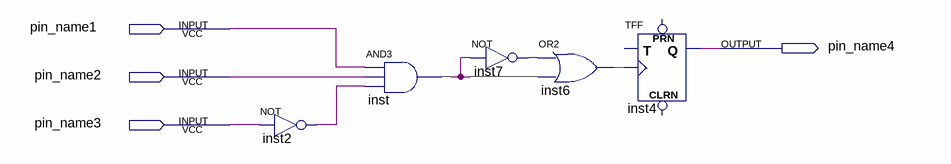
[diagram p0: schematic sheet]
// Quartus schematic Block1.bdf as structural Verilog: 5 symbols, 4 pins
module Block1 (
  input  pin_name1,
  input  pin_name2,
  input  pin_name3,
  output pin_name4
);

  wire inst2_out, inst7_out, undriven;

  not inst2 (inst2_out, pin_name3);
  // AND3 inst has open pins: IN1=pin_name1, IN2=pin_name2, IN3=inst2_out, OUT=open
  not inst7 (inst7_out, undriven);
  // OR2 inst6 has open pins: IN1=inst7_out, IN2=open, OUT=open
  TFF inst4 (.Q(pin_name4));  // open: PRN, CLRN, T, CLK
endmodule
